# EAGLE design source_eagle (EAGLE 9.6.2)
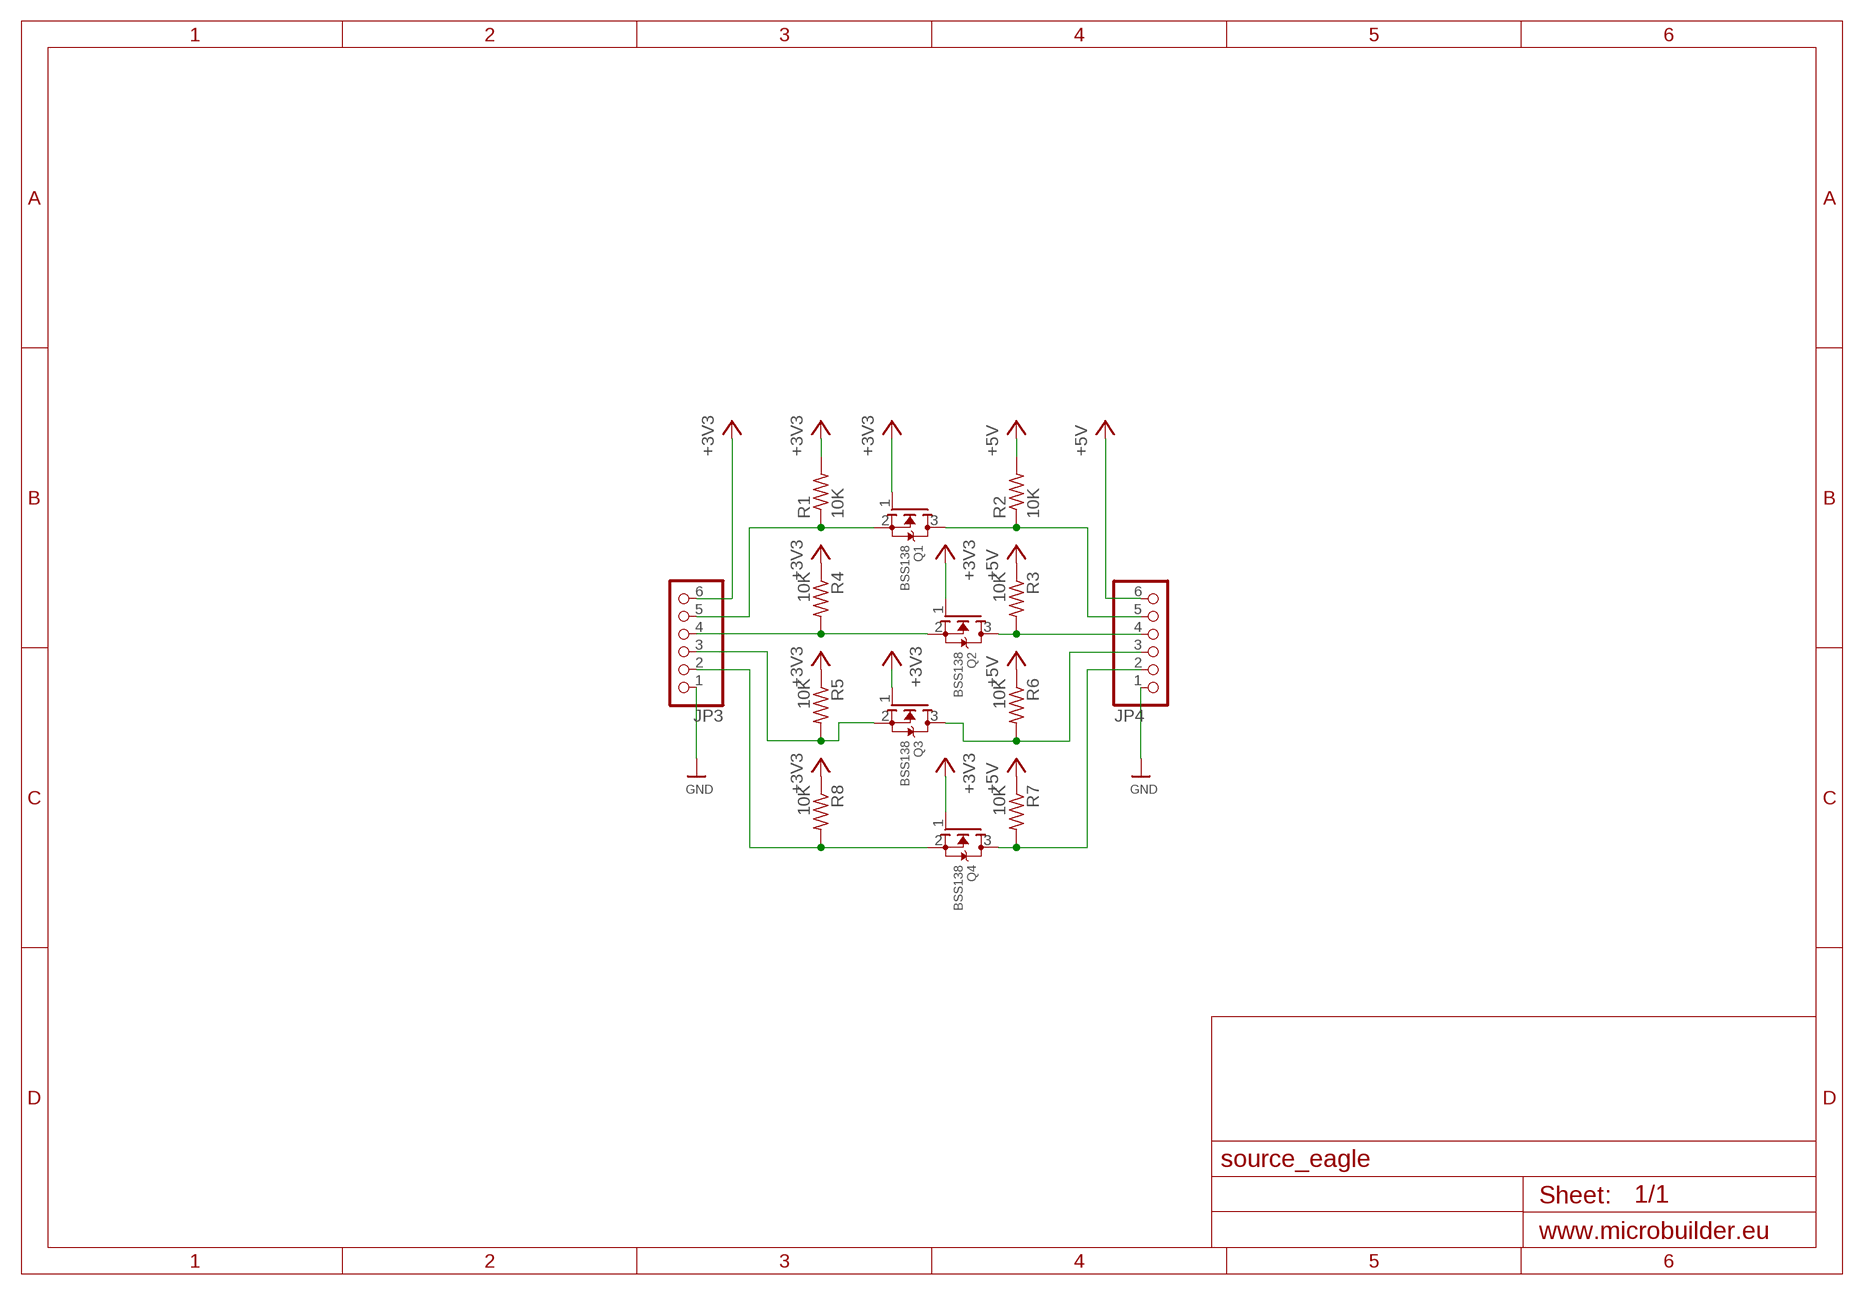
[diagram p0: schematic, sheet 1]

## Parts
JP3  PINHD-1X6CB  [1X06-CLEANBIG]
JP4  PINHD-1X6CB  [1X06-CLEANBIG]
Q1  BSS138  MOSFET-NREFLOW  [SOT23]
Q2  BSS138  MOSFET-NREFLOW  [SOT23]
Q3  BSS138  MOSFET-NREFLOW  [SOT23]
Q4  BSS138  MOSFET-NREFLOW  [SOT23]
R1  10K  R-US_R0805  [R0805]
R2  10K  R-US_R0805  [R0805]
R3  10K  R-US_R0805  [R0805]
R4  10K  R-US_R0805  [R0805]
R5  10K  R-US_R0805  [R0805]
R6  10K  R-US_R0805  [R0805]
R7  10K  R-US_R0805  [R0805]
R8  10K  R-US_R0805  [R0805]

## Nets
+3V3: JP3.6 Q1.1(G) Q2.1(G) Q3.1(G) Q4.1(G) R1.2 R4.1 R5.1 R8.1
+5V: JP4.6 R2.2 R3.1 R6.1 R7.1
GND: JP3.1 JP4.1
N$1: JP4.3 Q3.3(D) R6.2
N$2: JP4.5 Q1.3(D) R2.1
N$3: JP3.3 Q3.2(S) R5.2
N$4: JP3.2 Q4.2(S) R8.2
N$5: JP4.2 Q4.3(D) R7.2
N$6: JP3.4 Q2.2(S) R4.2
N$8: JP4.4 Q2.3(D) R3.2
N$9: JP3.5 Q1.2(S) R1.1

## Library data of the parts
JP3 JP4 = adafruit:PINHD-1X6: PIN HEADER
Q1-Q4 = adafruit:MOSFET-N: N-Channel Mosfet 2N7002E - 60V 260mA SOT23 [Digikey: 2N7002ET1GOSTR-ND] - REEL BSH103 - 30V 850mA SOT23 [Digikey: 568-5013-1-ND]
R1-R8 = adafruit:R-US_: RESISTOR, American symbol

## Board
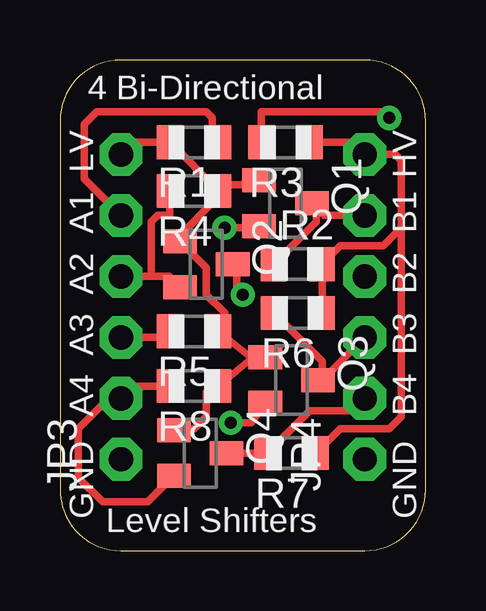
[diagram p1: board, top side]
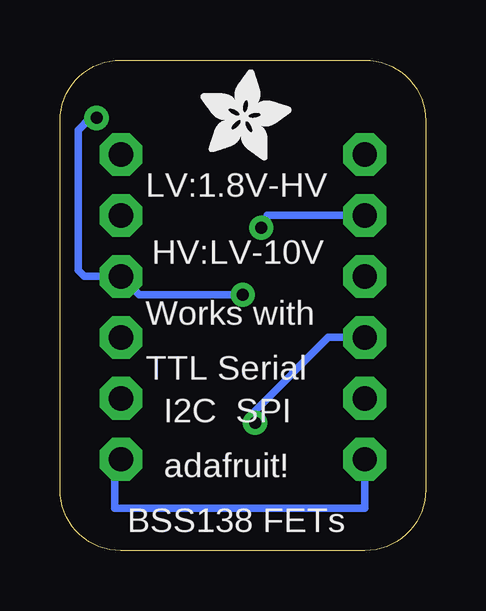
[diagram p2: board, bottom side, seen from below]

Size 15.24 x 20.45 mm. Coordinates in mm from the lower left corner, seen from the top.
Outline: 12.7,0 arc90 15.24,2.54 15.24,17.91 arc90 12.7,20.45 2.54,20.45 arc90 0,17.91 0,2.54 arc90 2.54,0 12.7,0
Copper layers (1*16): Top 0.035mm / dielectric 1.5mm / Bottom 0.035mm
Design rules "default *": minimum track width 8mil, minimum drill 0.4mm, track to track 8mil, track to pad 8mil, pad to pad 8mil, via to via 8mil, smd to smd 8mil, copper to edge 20mil, drill to drill 8mil, minimum pad ring 8mil, minimum via ring 10mil, stop-mask expansion 3mil, vias tented up to drill 20mil, thermal gap 8mil

### Footprints (pad centres in the part's own frame; a part is rotated, then mirrored left to right if it is on the bottom)
1X06-CLEANBIG = drill 1.016 pad 1.778 octagon: 1 -6.35,0; 2 -3.81,0; 3 -1.27,0; 4 1.27,0; 5 3.81,0; 6 6.35,0
SOT23 = smd 1 x 1.4: 1 -0.95,-1.1; 2 0.95,-1.1; 3 0,1.1
R0805 = smd 1.1 x 1.4: 1 -1,0; 2 1,0

### Placement (x,y rotation side)
JP3  2.54,10.16 90 top
JP4  12.7,10.16 90 top
Q1  9.4,14.48 270 top
Q2  6.1,11.94 270 top
Q3  9.65,7.11 270 top
Q4  5.84,4.06 270 top
R1  5.59,17.02 180 top
R2  9.91,11.94 0 top
R3  9.4,17.02 180 top
R4  5.59,14.99 180 top
R5  5.59,9.14 180 top
R6  9.91,9.91 180 top
R7  9.65,4.06 180 top
R8  5.59,6.86 180 top
U$1  [ADAFRUIT_3.5MM]  9.4,16.26 0 bottom

### Tracks (layer width: path | path; a pad name or v marks a point on that pad's centre or on a via)
+3V3
  Top 0.305: JP3.6 3.05,17.02 R1.2 6.62,14.99 | R4.1 6.62,14.99 | 6.62,14.99 6.86,14.99 | Q1.1 8.13,15.26 8.13,15.24 6.84,15.24 R4.1 | R4.1 6.35,14.99 6.35,14.5 5.08,13.21 5.08,12.97 Q2.1 6.1,11.79 6.1,10.67 6.86,9.91 6.86,9.16 R5.1 7.86,8.13 8.11,8.13 | 8.87,8.13 8.89,8.13 | 8.87,8.13 Q3.1 8.74,8.13 | 8.11,8.13 R8.1 6.86,6.86 6.86,6.35 6.35,6.86 6.1,6.6 6.1,5.59 5.59,5.08 4.81,5.08 Q4.1 | 8.74,8.13 8.87,8.13 | 8.11,8.13 8.38,8.13 8.74,8.13
+5V
  Top 0.305: R3.1 12.19,17.02 JP4.6 13.97,16.51 14.22,16.26 14.22,13.46 | R6.1 10.92,9.92 10.92,11.94 R2.2 11.67,12.7 13.46,12.7 14.22,13.46 | R7.1 11.67,5.08 13.72,5.08 14.22,5.59 14.22,13.46
GND
  Bottom 0.305: JP3.1 2.54,1.78 12.95,1.78 12.95,3.81 JP4.1
N$1
  Top 0.305: R6.2 10.92,7.89 10.92,7.11 | 10.92,7.11 Q3.3 | 10.92,7.11 JP4.3
N$2
  Top 0.305: Q1.3 11.01,13.97 JP4.5 | Q1.3 10.16,14.48 | Q1.3 10.67,14.48 10.67,13.7 R2.1
N$3  (via drill 0.5)
  Top 0.305: R5.2 4.59,8.89 JP3.3 | Q3.2 7.98,5.33 v7.11,5.33
  Bottom 0.305: v7.11,5.33 7.11,5.84 4.06,8.89 JP3.3
N$4
  Top 0.305: R8.2 3.05,6.86 JP3.2 2.03,6.35 0.76,5.08 0.76,3.05 1.78,2.03 3.66,2.03 Q4.2
N$5
  Top 0.305: JP4.2 12.19,5.84 10.41,5.84 8.64,4.06 R7.2 Q4.3 6.86,4.06
N$6
  Top 0.305: 2.29,11.43 JP3.4 3.81,11.43 | Q2.2 4.55,11.43 3.81,11.43 | 4.33,15.24 R4.2 4.57,14.97 4.57,13.97 4.06,13.97 3.81,13.72 3.81,11.43
N$8  (via drill 0.5)
  Top 0.305: Q2.3 7.37,11.94 7.37,10.92 v7.62,10.67 | R3.2 8.38,17.03 8.38,18.29 13.46,18.29 v13.72,18.03
  Bottom 0.305: v7.62,10.67 11.94,10.67 JP4.4 14.22,11.43 14.48,11.68 14.48,17.53 13.97,18.03 v13.72,18.03
N$9  (via drill 0.5)
  Top 0.305: JP3.5 1.02,15.49 1.02,17.78 1.52,18.29 6.1,18.29 6.35,18.03 6.35,17.02 R1.1 | Q1.2 8.23,13.46 v6.86,13.46
  Bottom 0.305: v6.86,13.46 6.6,13.97 JP3.5

### Text on the board
tPlace: 4 Bi-Directional | HV | LV | B1 | A1 | B2 | A2 | B3 | A3 | B4 | A4 | GND | GND | Level Shifters
bPlace: LV:1.8V-HV | HV:LV-10V | Works with | TTL Serial | I2C SPI | adafruit! | BSS138 FETs